# Altium schematic sheet schem1.SchDoc
size A
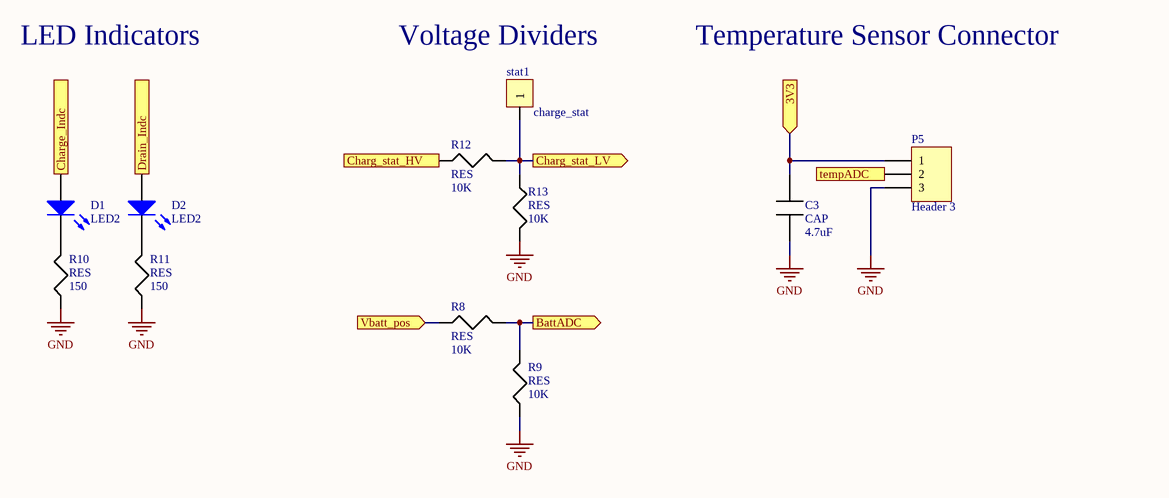
[diagram p0: schem1.SchDoc]

## Parts
C3  CAP  value 4.7uF  [Cap 0603 (1608 metric)]
D1  LED2  [3.2X1.6X1.1]
D2  LED2  [3.2X1.6X1.1]
P5  Header 3  [HDR1X3]
R8  RES  value 10K  [Res 0603 (1608 metric)]
R9  RES  value 10K  [Res 0603 (1608 metric)]
R10  RES  value 150  [Res 0603 (1608 metric)]
R11  RES  value 150  [Res 0603 (1608 metric)]
R12  RES  value 10K  [Res 0603 (1608 metric)]
R13  RES  value 10K  [Res 0603 (1608 metric)]
stat1  charge_stat  [test pad]

## Ports
3V3 (in), BattADC (out), Charg_stat_HV (in), Charg_stat_LV (out), Charge_Indc (in), Drain_Indc (in), tempADC (in), Vbatt_pos (in)

## Nets
GND: C3.1 P5.3 R9.1 R10.1 R11.1 R13.2
3V3: C3.2 P5.1 ; port 3V3
BattADC: R8.2 R9.2 ; port BattADC
Charg_stat_HV: R12.1 ; port Charg_stat_HV
Charg_stat_LV: R12.2 R13.1 stat1.1 ; port Charg_stat_LV
Charge_Indc: D1.1(A) ; port Charge_Indc
Drain_Indc: D2.1(A) ; port Drain_Indc
tempADC: P5.2 ; port tempADC
Vbatt_pos: R8.1 ; port Vbatt_pos
NetD1_2: D1.2(K) R10.2
NetD2_2: D2.2(K) R11.2

## Notes on the sheet
- LED Indicators
- Voltage Dividers
- Temperature Sensor Connector

## Library data of the parts
D1 D2 = LED2: Typical RED, GREEN, YELLOW, AMBER GaAs LED; Published: 8-Jun-2000; LatestRevisionDate: 17-Jul-2002; LatestRevisionNote: Re-released for DXP Platform.; PackageVersion: Feb-2002; PackageReference: 3.2X1.6X1.1; Publisher: Altium Limited; PackageDescription: SM LED; 2 Flat Leads
P5 = Header 3: Header, 3-Pin; LatestRevisionDate: 17-Jul-2002; LatestRevisionNote: Re-released for DXP Platform.; Publisher: Altium Limited
stat1 = test_pad: test pad